# EAGLE design wharehauora-minisensor (EAGLE 7.2.0)
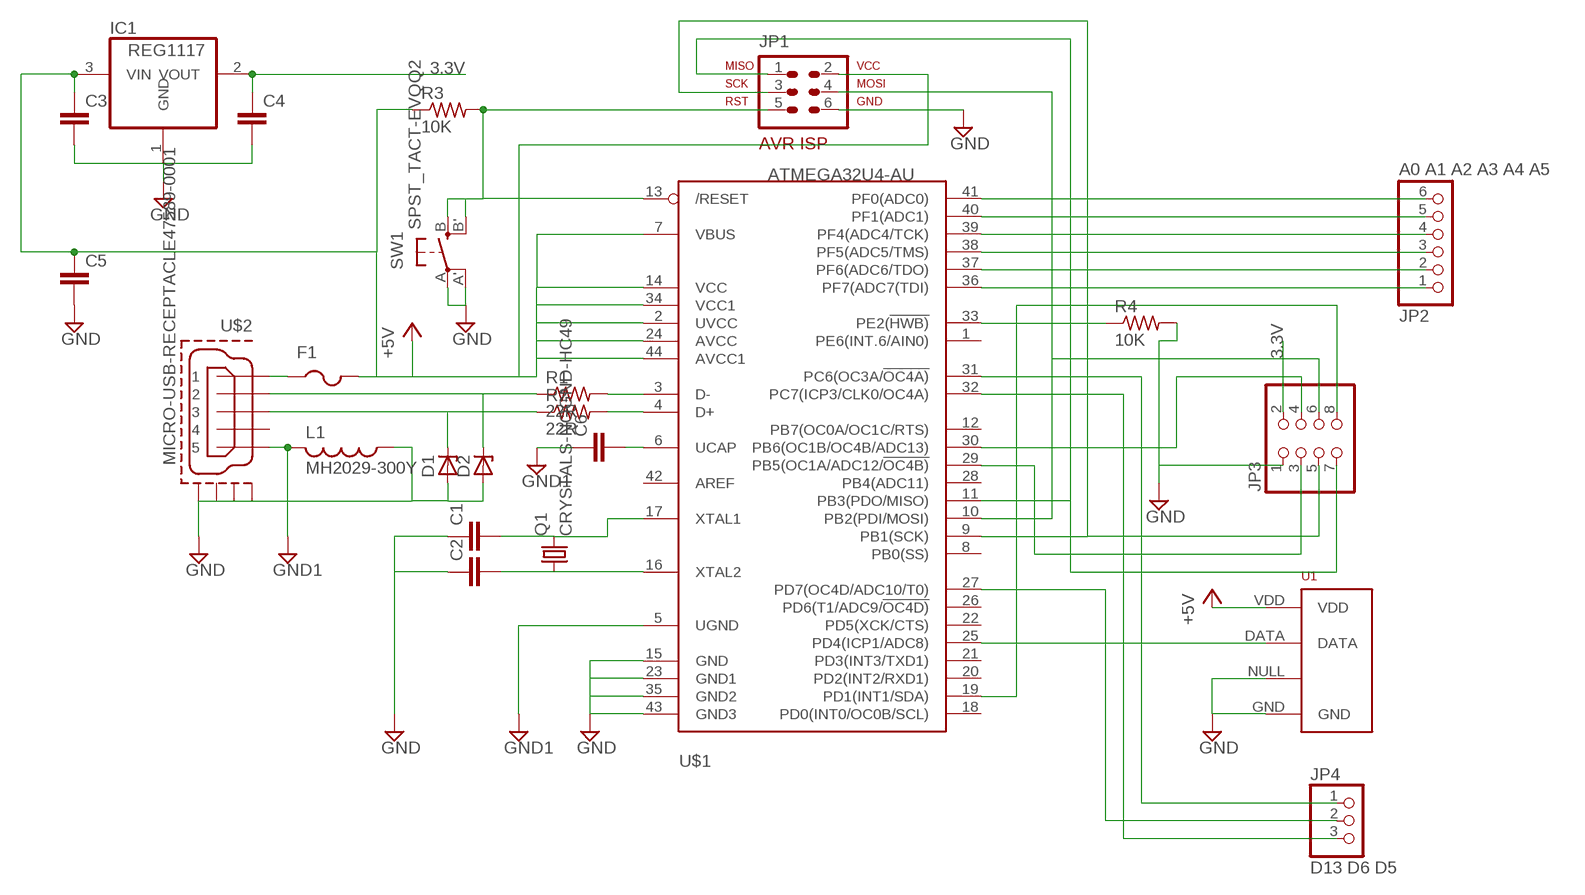
[diagram p0: schematic, sheet 1]

## Parts
C1  CC0603  [C0603]
C2  CC0603  [C0603]
C3  C-EUC0805  [C0805]
C4  C-EUC0805  [C0805]
C5  C-EUC0603  [C0603]
C6  C-EUC0805  [C0805]
D1  ZENER-DIODESOD80C  [SOD80C]
D2  ZENER-DIODESOD80C  [SOD80C]
F1  PTCFUSE-1812  [1812]
IC1  REG1117  [SOT223]
JP1  AVR-ISP-6VERT  [AVR-ISP-6]
JP2  A0 A1 A2 A3 A4 A5  PINHD-1X6  [1X06]
JP3  PINHD-2X4  [2X04]
JP4  D13 D6 D5  PINHD-1X3  [1X03]
L1  MH2029-300Y  L-USL2012C  [L2012C]
Q1  CRYSTALS-NOGND-HC49  [HC49]
R1  22R  R-US_R0603  [R0603]
R2  22R  R-US_R0603  [R0603]
R3  10K  R-US_R0603  [R0603]
R4  10K  R-US_R0603  [R0603]
SW1  SPST_TACT-EVQQ2  [EVQ-Q2]
U1  RHT03_DHT-22_AM2302RA  [RHT03_DHT-22/RA]
U$1  ATMEGA32U4-AU  [TQFP44]
U$2  MICRO-USB-RECEPTACLE47589-0001  [47589-0001]

## Nets
3.3V: C4.1 IC1.2(VOUT) JP3.2
+5V: C3.1 C5.1 F1.2 IC1.3(VIN) JP1.2 R3.1 U1.VDD U$1.2(UVCC) U$1.7(VBUS) U$1.14(VCC) U$1.24(AVCC) U$1.34(VCC1) U$1.44(AVCC1)
GND: C1.1 C2.1 C3.2 C4.2 C5.2 D1.A D2.A IC1.1(GND) JP1.6 JP3.1 L1.1 R4.2 SW1.A'(P1) SW1.A(P) U1.GND U1.NULL U$1.15(GND) U$1.23(GND1) U$1.35(GND2) U$1.43(GND3) U$2.CASING1(GND1) U$2.CASING2(GND2) U$2.CASING3(GND3) U$2.CASING4(GND4)
GND1: C6.1 L1.2 U$1.5(UGND) U$2.5
N$1: R1.2 U$1.3(D-)
N$2: R2.2 U$1.4(D+)
N$3: D1.C R2.1 U$2.3
N$4: D2.C R1.1 U$2.2
N$5: C1.2 Q1.2 U$1.17(XTAL1)
N$6: F1.1 U$2.1
N$7: C2.2 Q1.1 U$1.16(XTAL2)
N$8: JP3.3 U$1.29(PB5(OC1A/ADC12/!OC4B))
N$9: JP3.4 U$1.30(PB6(OC1B/OC4B/ADC13))
N$10: JP1.5 R3.2 SW1.B'(S1) SW1.B(S) U$1.13(/RESET)
N$11: JP1.3 JP3.5 U$1.9(PB1(SCK))
N$12: JP1.1 JP3.7 U$1.11(PB3(PDO/MISO))
N$13: JP1.4 JP3.6 U$1.10(PB2(PDI/MOSI))
N$14: JP3.8 U$1.19(PD1(INT1/SDA))
N$15: JP2.1 U$1.36(PF7(ADC7(TDI))
N$16: JP2.2 U$1.37(PF6(ADC6/TDO))
N$17: JP2.3 U$1.38(PF5(ADC5/TMS))
N$18: JP2.4 U$1.39(PF4(ADC4/TCK))
N$19: JP2.5 U$1.40(PF1(ADC1))
N$20: JP2.6 U$1.41(PF0(ADC0))
N$21: U1.DATA U$1.25(PD4(ICP1/ADC8))
N$22: C6.2 U$1.6(UCAP)
N$23: R4.1 U$1.33(PE2(!HWB))
N$24: JP4.2 U$1.27(PD7(OC4D/ADC10/T0))
N$25: JP4.1 U$1.31(PC6(OC3A/!OC4A))
N$26: JP4.3 U$1.32(PC7(ICP3/CLK0/OC4A))
Unconnected: U$1.1(PE6(INT.6/AIN0)) U$1.8(PB0(SS)) U$1.12(PB7(OC0A/OC1C/RTS)) U$1.18(PD0(INT0/OC0B/SCL)) U$1.20(PD2(INT2/RXD1)) U$1.21(PD3(INT3/TXD1)) U$1.22(PD5(XCK/CTS)) U$1.26(PD6(T1/ADC9/!OC4D)) U$1.28(PB4(ADC11)) U$1.42(AREF) U$2.4

## Library data of the parts
C1 C2 = eagle-ltspice:C: CAPACITOR, European symbol; SPICEMODEL: NONE; SPICEPREFIX: C
C3-C6 = rcl:C-EU: CAPACITOR, European symbol
D1 D2 = diode:ZENER-DIODE: Z-Diode
F1 = adafruit:PTCFUSE: PTC fuses, resettable thermistors
IC1 = burr-brown:REG1117: 800mA and 1A Low Dropout (LDO) Positive Regulator 1.8V, 2.5V, 2.85V, 3.3V, 5V, and Adj; MPN: REG1117; OC_FARNELL: 1097566; OC_NEWARK: 14P6981
JP1 = avr-7 (1):AVR-ISP-6: AVR ISP-6 Serial Programming Header
JP2 = adafruit:PINHD-1X6: PIN HEADER
JP3 = pinhead:PINHD-2X4: PIN HEADER
JP4 = adafruit:PINHD-1X3: PIN HEADER
L1 = resistor:L-US: INDUCTOR, American symbol
Q1 = IQD-Frequency-Products:CRYSTALS-NOGND: CRYSTALS CAN NOT GROUNDED
R1-R4 = adafruit:R-US_: RESISTOR, American symbol
SW1 = adafruit:SPST_TACT: SMT 6mm switch, EVQQ2 series http://www.ladyada.net/library/eagle
U1 = RHT03_DHT-22_AM2302:RHT03_DHT-22_AM2302: RHT03 / DHT-22 / AM2302 Packages and symbol for the RHT03 / DHT-22 relative humidity and temperature sensor. Note: The AM2302 is a wired version of the DHT-22 which typically requires less clearance and is thus provided as a separate package.; PROD_ID: SEN-10167
U$1 = adafruit:ATMEGA32U4: http://www.ladyada.net/library/eagle
U$2 = con-molex-usb:MICRO-USB-RECEPTACLE: MICRO USB RECEPTACLES Micro-USB Receptacles, SMT, Lead-Free from MOLEX <http://www.molex.com/>. (C) 2014 Tomasz Boleslaw CEDRO, cederom@tlen.pl, http://www.tomek.cedro.info. Version 0.1 (2014-01-17): Initial release. Version 0.2 (2014-02-06): Updated 47589-0001 footprint pins/pads/milling. Following devices are included: 1. 47589-0001 Micro-USB AB Receptacle, Bottom Mount, SMT, Lead-Free <http://www.molex.com/molex/products/datasheet.jsp?part=active/0475890001_IO_CONNECTORS.xml> (Technical Drawing <http://www.molex.com/pdm_docs/sd/475890001_sd.pdf>).

## Board
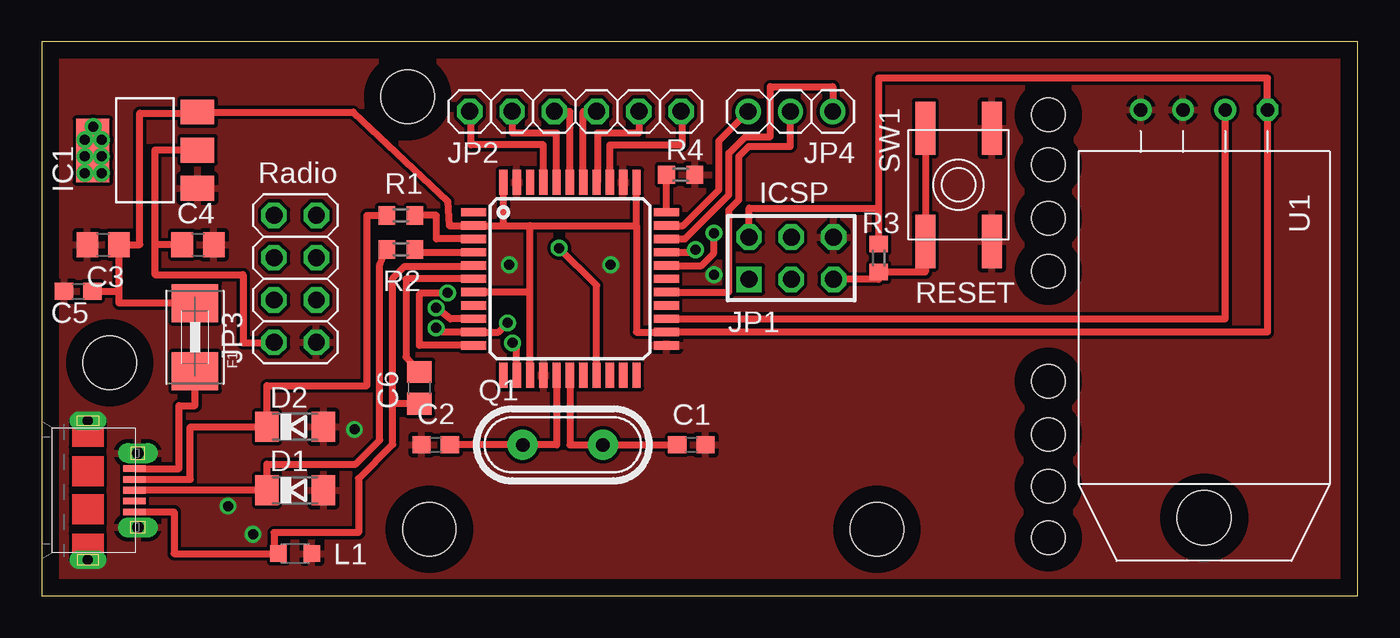
[diagram p1: board, top side]
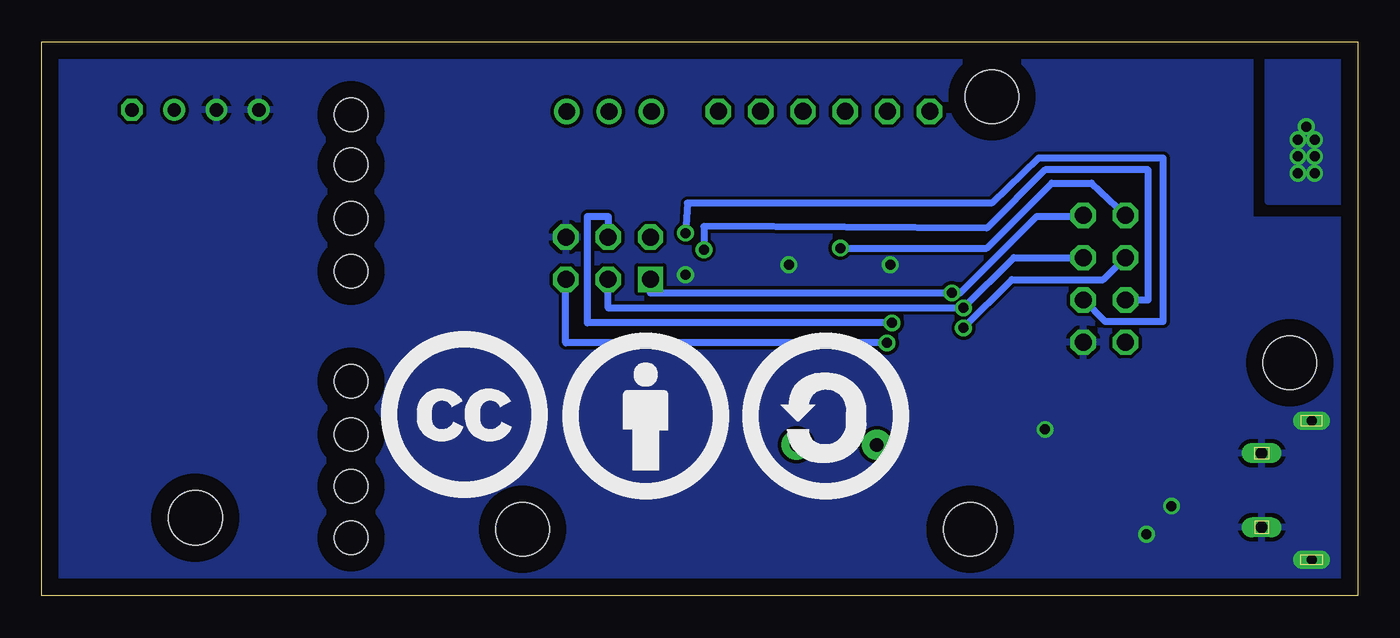
[diagram p2: board, bottom side, seen from below]

Size 79.1 x 33.3 mm. Coordinates in mm from the lower left corner, seen from the top.
Outline: 0,0 79.1,0 79.1,33.3 0,33.3 0,0
Copper layers (1*16): Top 0.035mm / dielectric 1.5mm / Bottom 0.035mm
Design rules "default": minimum track width 10mil, minimum drill 24mil, track to track 8mil, track to pad 8mil, pad to pad 8mil, via to via 8mil, smd to smd 8mil, copper to edge 40mil, drill to drill 8mil, minimum pad ring 10mil, minimum via ring 8mil, stop-mask expansion 4mil, vias tented up to drill 0mil, thermal gap 10mil
Holes 2 mm at 60.5,28.9 60.5,22.7 60.5,19.5 60.5,12.9 60.5,9.7 60.5,6.6 60.5,3.5 60.5,25.9
Holes 3.2 mm at 22,30 50.2,4 23.3,4 4.1,14

### Footprints (pad centres in the part's own frame; a part is rotated, then mirrored left to right if it is on the bottom)
C0603 = smd 1.1 x 1: 1 -0.85,0; 2 0.85,0
C0805 = smd 1.3 x 1.5: 1 -0.95,0; 2 0.95,0
SOD80C = smd 1.4 x 1.8: A 1.7,0; C -1.7,0
1812 = smd 2.286 x 2.794: 1 -2.046,0; 2 2.046,0
SOT223 = smd 1.499 x 2.007: 1 -2.261,-3.15; 2 0.025,-3.15; 3 2.311,-3.15 | smd 3.81 x 2.007: 4 0,3.15
AVR-ISP-6 = drill 1.016 square: 1 -2.54,-1.27 | drill 1.016 octagon: 2 -2.54,1.27; 3 0,-1.27; 4 0,1.27; 5 2.54,-1.27; 6 2.54,1.27
1X06 = drill 1.016 octagon: 1 -6.35,0; 2 -3.81,0; 3 -1.27,0; 4 1.27,0; 5 3.81,0; 6 6.35,0
2X04 = drill 1.016 octagon: 1 -3.81,-1.27; 2 -3.81,1.27; 3 -1.27,-1.27; 4 -1.27,1.27; 5 1.27,-1.27; 6 1.27,1.27; 7 3.81,-1.27; 8 3.81,1.27
1X03 = drill 1.016: 1 -2.54,0; 2 0,0; 3 2.54,0
L2012C = smd 1 x 1: 1 -1,0; 2 1,0
HC49 = drill 0.813 pad 1.8: 1 -2.413,0; 2 2.413,0
R0603 = smd 1 x 1.1: 1 -0.85,0; 2 0.85,0
EVQ-Q2 = smd 3.2 x 1.2: A -3.4,-2; A' 3.4,-2; B -3.4,2; B' 3.4,2
RHT03_DHT-22/RA = drill 0.8: DATA -1.27,0; GND 3.81,0; NULL 1.27,0 | drill 0.8 octagon: VDD -3.81,0 | hole 3.25: 0,24.5
TQFP44 = smd 1.5 x 0.5: 1 -5.8,4; 2 -5.8,3.2; 3 -5.8,2.4; 4 -5.8,1.6; 5 -5.8,0.8; 6 -5.8,0; 7 -5.8,-0.8; 8 -5.8,-1.6; 9 -5.8,-2.4; 10 -5.8,-3.2; 11 -5.8,-4; 23 5.8,-4; 24 5.8,-3.2; 25 5.8,-2.4; 26 5.8,-1.6; 27 5.8,-0.8; 28 5.8,0; 29 5.8,0.8; 30 5.8,1.6; 31 5.8,2.4; 32 5.8,3.2; 33 5.8,4 | smd 0.5 x 1.5: 12 -4,-5.8; 13 -3.2,-5.8; 14 -2.4,-5.8; 15 -1.6,-5.8; 16 -0.8,-5.8; 17 0,-5.8; 18 0.8,-5.8; 19 1.6,-5.8; 20 2.4,-5.8; 21 3.2,-5.8; 22 4,-5.8; 34 4,5.8; 35 3.2,5.8; 36 2.4,5.8; 37 1.6,5.8; 38 0.8,5.8; 39 0,5.8; 40 -0.8,5.8; 41 -1.6,5.8; 42 -2.4,5.8; 43 -3.2,5.8; 44 -4,5.8
47589-0001 = smd 1.35 x 0.4: 1 2.8,1.3; 2 2.8,0.65; 3 2.8,0; 4 2.8,-0.65; 5 2.8,-1.3 | drill 0.6 pad 0.95 long: CASING1 0,4.175; CASING2 0,-4.175 | drill 0.7 pad 1.1 long: CASING3 3,2.225; CASING4 3,-2.225

### Placement (x,y rotation side)
C1  39.05,9.08 180 top
C2  23.69,9.08 0 top
C3  3.7,21.1 180 top
C4  9.4,21.1 0 top
C5  2.2,18.3 180 top
C6  22.7,12.5 90 top
D1  15.24,6.35 0 top
D2  15.24,10.16 0 top
F1  9.22,15.54 90 top
IC1  6.22,26.76 90 top
JP1  45.05,20.29 0 top
JP2  32.08,29.11 180 top
JP3  15.24,19.05 90 top
JP4  45,29.1 180 top
L1  15.24,2.54 180 top
Q1  31.32,9.08 0 top
R1  21.59,22.86 0 top
R2  21.59,20.82 0 top
R3  50.3,20.3 270 top
R4  38.4,25.3 0 top
SW1  55.1,24.7 90 top
U1  69.86,29.2 180 top
U$1  31.75,19.05 0 top
U$2  2.78,6.35 0 top
U$3  [CC_TPLACE]  58.7,5.9 0 bottom
U$4  [BY_TPLACE]  47.8,5.8 0 bottom
U$5  [SA_TPLACE]  37,5.8 0 bottom

### Tracks (layer width: path | path; a pad name or v marks a point on that pad's centre or on a via)
3.3V
  Top 0.406: IC1.2 6.8,26.79 6.8,21.1 | 6.8,21.1 6.8,19.3 12.1,19.3 12.1,15.2 13.97,15.2 JP3.2 | C4.1 6.8,21.1
+5V
  Top 0.406: 25.95,22.3 U$1.2 | U$1.2 27.75,22.25 U$1.44 | U$1.2 29.35,22.25 | 29.35,22.25 35.75,22.25 | 35.75,22.25 U$1.34 | 35.75,22.25 35.75,15.85 U$1.24 73.67,15.85 U1.VDD 73.67,31.1 50.3,31.1 50.3,23.3 | U$1.14 29.35,18.1 | 29.35,18.1 29.35,22.25 | 29.35,18.1 29.2,18.25 U$1.7 | 50.3,21.1 R3.1 50.3,23.3 | U$1.2 24.5,22.25 24.4,23.7 18.73,29.07 IC1.3 9.37,29 5.9,29 5.9,21.1 C3.1 4.65,18.4 4.65,18.3 | JP1.2 42.51,23.3 50.3,23.3 | F1.2 4.65,17.59 4.65,18.3 | C5.1 4.65,18.3
GND  (via drill 0.6)
  other vias: 28.1,19.9 34.2,19.9 18.8,10 11.2,5.4 12.7,3.7 40.4,19.3
  pour Top: 0,33.25 79.27,33.35 79.17,0 0,0
  pour Bottom: 0.1,0.1 79.1,0.1 79.1,33.3 6.5,33.3 6.5,22.6 0.1,22.6
GND1
  Top 0.406: U$2.5 7.96,5.05 7.96,2.54 L1.2 13.97,2.54 13.97,3.81 19.05,3.81 19.05,7.05 21.1,9.1 21.1,11.5 | 21.1,11.5 21.1,19.1 21.8,19.8 25.9,19.8 U$1.5 | C6.1 21.15,11.55 21.1,11.5
N$1
  Top 0.406: U$1.3 23.73,21.45 23.73,22.86 R1.2
N$2
  Top 0.406: R2.2 22.44,20.65 U$1.4
N$3
  Top 0.406: U$2.3 D1.C 13.54,7.92 18.88,7.92 20.32,9.36 20.32,19.9 R2.1
N$4
  Top 0.406: U$2.2 8.93,7 8.93,10.16 D2.C 13.54,12.63 19.55,12.63 19.55,22.86 R1.1
N$5
  Top 0.406: U$1.17 31.75,9.08 Q1.2 C1.2
N$6
  Top 0.406: U$2.1 8.26,7.65 8.26,11.43 9.22,11.43 F1.1
N$7
  Top 0.406: U$1.16 30.95,9.08 Q1.1 C2.2
N$8  (via drill 0.6)
  Top 0.406: U$1.29 39.65,19.85 40.4,20.6 v40.4,21.8
  Bottom 0.406: JP3.3 16.48,17.78 15.2,16.5 11.7,16.5 11.7,26.3 19.2,26.3 22,23.6 40.3,23.6 v40.4,21.8
N$9  (via drill 0.6)
  Top 0.406: U$1.30 39.3,20.65 v39.3,20.8
  Bottom 0.406: JP3.4 12.6,17.78 12.6,25.6 18.8,25.6 22.3,22.1 39.3,22.2 v39.3,20.8
N$10  (via drill 0.6)
  Top 0.406: U$1.13 28.55,15.15 v28.3,15.2 | JP1.5 50.3,19.02 R3.2 53.1,19.45 SW1.B SW1.B'
  Bottom 0.406: v28.3,15.2 47.6,15.2 JP1.5
N$11  (via drill 0.6)
  Top 0.406: U$1.9 24.55,16.65 v23.7,17.3
  Bottom 0.406: JP3.5 20.68,20.32 v23.7,17.3 45.05,17.3 JP1.3
N$12  (via drill 0.6)
  Top 0.406: 25.75,15.05 U$1.11 22.7,15.05 22.7,18.1 22.8,18.2 v24.4,18.2
  Bottom 0.406: JP1.1 42.51,18.2 v24.4,18.2 23.9,18.2 19.3,22.8 16.57,22.8 JP3.7
N$13  (via drill 0.6)
  Top 0.406: v23.7,16.1 24.05,15.85 U$1.10 27.45,15.85 v28,16.4
  Bottom 0.406: JP3.6 15.3,19 20.8,19 v23.7,16.1 | v28,16.4 46.3,16.4 46.3,22.8 45.05,22.8 JP1.4
N$14  (via drill 0.6)
  Top 0.406: U$1.19 33.35,18.65 v31.1,20.9
  Bottom 0.406: v31.1,20.9 22.3,20.9 18.4,24.8 16.01,24.8 JP3.8
N$15
  Top 0.406: U$1.36 34.15,27.1 38.5,27.1 38.5,29.11 JP2.1
N$16
  Top 0.406: JP2.2 35.89,27.8 33.4,27.8 33.4,24.85 U$1.37
N$17
  Top 0.406: U$1.38 32.55,29.1 33.4,29.1 33.4,29.11 JP2.3
N$18
  Top 0.406: U$1.39 31.75,29.1 30.9,29.1 JP2.4
N$19
  Top 0.406: U$1.40 30.95,27.8 28.3,27.8 28.3,29.11 JP2.5
N$20
  Top 0.406: U$1.41 30.15,27.1 25.8,27.1 25.8,29.11 JP2.6
N$21
  Top 0.406: 37.55,16.6 U$1.25 71.13,16.65 U1.DATA
N$22
  Top 0.406: U$1.6 21.9,19.05 21.9,14.35 C6.2
N$23
  Top 0.406: U$1.33 R4.1
N$24
  Top 0.406: U$1.27 41.3,18.25 41.3,23.2 41.9,23.8 41.9,26.4 42.5,27 45,27 JP4.2
N$25
  Top 0.406: U$1.31 38.65,21.45 41.3,24.1 41.3,26.6 42.3,27.6 43.8,27.6 43.8,30.6 47.54,30.6 JP4.1
N$26
  Top 0.406: U$1.32 38.55,22.25 40.7,24.4 40.7,27.34 JP4.3
REGSINK  (via drill 0.6)
  other vias: 3.6,26.4 2.6,27.4 3.6,27.4 2.6,26.4 2.6,25.4 3.6,25.4 3.1,28.2
  pour Bottom: 5.4,23.7 0.2,23.7 0.2,33.2 5.4,33.2

### Text on the board
_tNames: Radio | ICSP | RESET